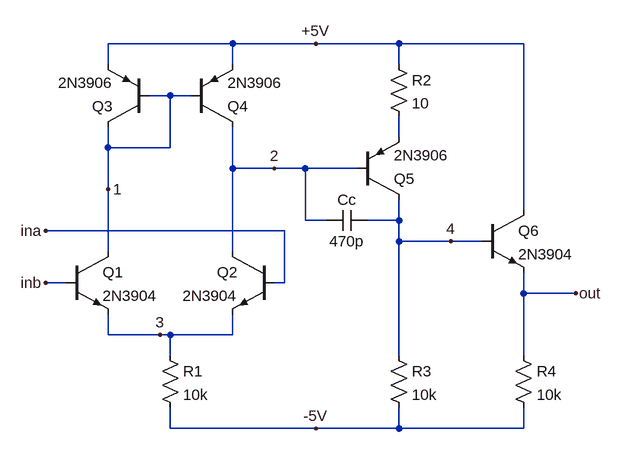
[diagram p0: schematic discrete-opamp3-fig1.asc]
discrete-opamp3-fig1.asc, the LTspice schematic file:
Version 4
SHEET 1 3556 680
WIRE 352 -208 160 -208
WIRE 480 -208 352 -208
WIRE 608 -208 480 -208
WIRE 800 -208 608 -208
WIRE 160 -176 160 -208
WIRE 352 -176 352 -208
WIRE 608 -176 608 -208
WIRE 256 -128 224 -128
WIRE 288 -128 256 -128
WIRE 608 -64 608 -96
WIRE 160 -48 160 -80
WIRE 256 -48 256 -128
WIRE 256 -48 160 -48
WIRE 352 -16 352 -80
WIRE 416 -16 352 -16
WIRE 464 -16 416 -16
WIRE 544 -16 464 -16
WIRE 160 16 160 -48
WIRE 800 48 800 -208
WIRE 464 64 464 -16
WIRE 496 64 464 64
WIRE 608 64 608 32
WIRE 608 64 560 64
WIRE 432 80 64 80
WIRE 608 96 608 64
WIRE 688 96 608 96
WIRE 736 96 688 96
WIRE 160 112 160 16
WIRE 352 112 352 -16
WIRE 96 160 64 160
WIRE 432 160 432 80
WIRE 432 160 416 160
WIRE 800 176 800 144
WIRE 880 176 800 176
WIRE 160 240 160 208
WIRE 240 240 160 240
WIRE 256 240 240 240
WIRE 352 240 352 208
WIRE 352 240 256 240
WIRE 256 272 256 240
WIRE 608 272 608 96
WIRE 800 272 800 176
WIRE 256 384 256 352
WIRE 480 384 256 384
WIRE 608 384 608 352
WIRE 608 384 480 384
WIRE 800 384 800 352
WIRE 800 384 608 384
FLAG 480 384 -5V
FLAG 480 -208 +5V
FLAG 64 80 ina
FLAG 64 160 inb
FLAG 880 176 out
FLAG 416 -16 2
FLAG 160 16 1
FLAG 688 96 4
FLAG 240 240 3
SYMBOL npn 96 112 R0
SYMATTR InstName Q1
SYMATTR Value 2N3904
SYMBOL npn 416 112 M0
SYMATTR InstName Q2
SYMATTR Value 2N3904
SYMBOL res 240 256 R0
SYMATTR InstName R1
SYMATTR Value 10k
SYMBOL pnp 544 32 M180
SYMATTR InstName Q5
SYMATTR Value 2N3906
SYMBOL res 592 256 R0
SYMATTR InstName R3
SYMATTR Value 10k
SYMBOL res 592 -192 R0
SYMATTR InstName R2
SYMATTR Value 10
SYMBOL cap 560 48 R90
WINDOW 0 0 32 VBottom 2
WINDOW 3 32 32 VTop 2
SYMATTR InstName Cc
SYMATTR Value 470p
SYMBOL pnp 224 -80 R180
SYMATTR InstName Q3
SYMATTR Value 2N3906
SYMBOL pnp 288 -80 M180
SYMATTR InstName Q4
SYMATTR Value 2N3906
SYMBOL npn 736 48 R0
SYMATTR InstName Q6
SYMATTR Value 2N3904
SYMBOL res 784 256 R0
SYMATTR InstName R4
SYMATTR Value 10k

The netlist it stands for:
* discrete-opamp3-fig1.asc
Q1 1 inb 3 0 2N3904
Q2 2 ina 3 0 2N3904
R1 3 -5V 10k
Q5 4 2 N001 0 2N3906
R3 4 -5V 10k
R2 +5V N001 10
Cc 4 2 470p
Q3 1 1 +5V 0 2N3906
Q4 2 1 +5V 0 2N3906
Q6 +5V 4 out 0 2N3904
R4 out -5V 10k
.model NPN NPN
.model PNP PNP
.lib standard.bjt
.backanno
.end